# Altium schematic sheet Elekid_03.SchDoc
size A4
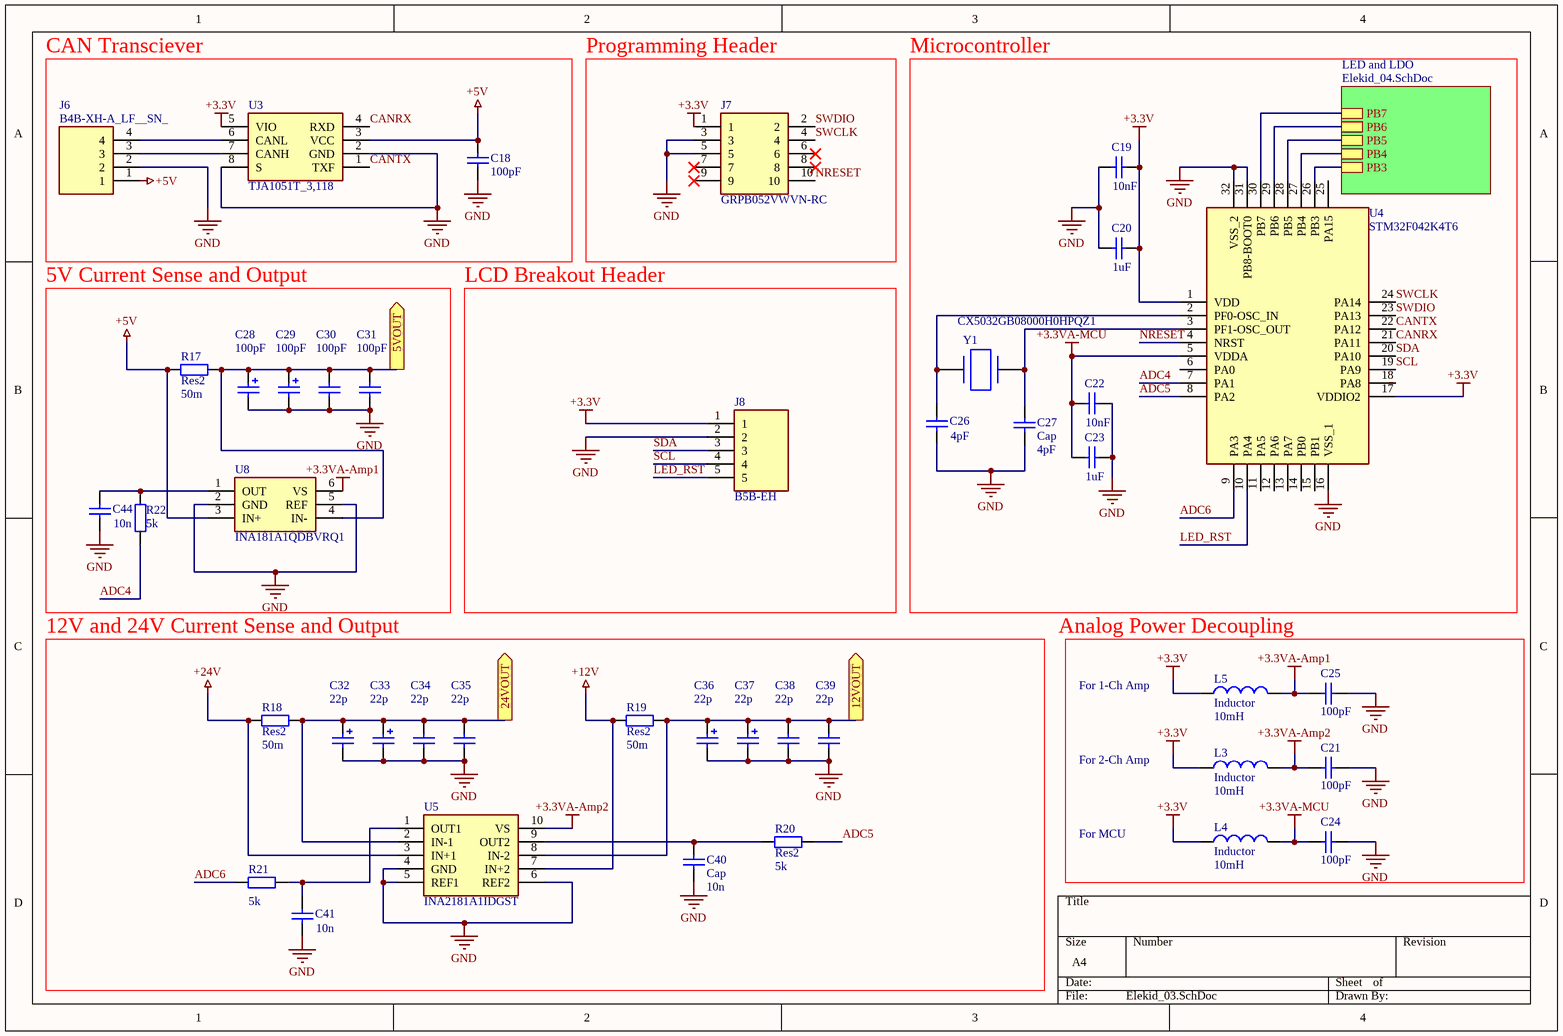
[diagram p0: Elekid_03.SchDoc]

## Parts
C18  value 100pF  [C0805]  (hidden comment: Cap)
C19  value 10nF  [C0805]  (hidden comment: Cap)
C20  value 1uF  [C0805]  (hidden comment: Cap)
C21  value 100pF  [C0805]  (hidden comment: Cap)
C22  value 10nF  [C0805]  (hidden comment: Cap)
C23  value 1uF  [C0805]  (hidden comment: Cap)
C24  value 100pF  [C0805]  (hidden comment: Cap)
C25  value 100pF  [C0805]  (hidden comment: Cap)
C26  value 4pF  [C0805]  (hidden comment: Cap)
C27  Cap  value 4pF  [C0805]
C28  value 100pF  [C0805]  (hidden comment: Cap Pol2)
C29  value 100pF  [C0805]  (hidden comment: Cap Pol2)
C30  value 100pF  [C0805]  (hidden comment: Cap)
C31  value 100pF  [C0805]  (hidden comment: Cap)
C32  value 22p  [C0805]  (hidden comment: Cap Pol2)
C33  value 22p  [C0805]  (hidden comment: Cap Pol2)
C34  value 22p  [C0805]  (hidden comment: Cap)
C35  value 22p  [C0805]  (hidden comment: Cap)
C36  value 22p  [C0805]  (hidden comment: Cap Pol2)
C37  value 22p  [C0805]  (hidden comment: Cap Pol2)
C38  value 22p  [C0805]  (hidden comment: Cap)
C39  value 22p  [C0805]  (hidden comment: Cap)
C40  Cap  value 10n  [C0805]
C41  value 10n  [C0805]  (hidden comment: Cap)
C44  value 10n  [C0805]  (hidden comment: Cap)
J6  B4B-XH-A_LF__SN_  [B4BXHALFSN]
J7  GRPB052VWVN-RC  [HDRV10W50P127_2X5_635X340X430P]
J8  B5B-EH  [SHDR5W64P0X250_1X5_1500X380X600P]
L3  Inductor  value 10mH  [c0805]
L4  Inductor  value 10mH  [c0805]
L5  Inductor  value 10mH  [c0805]
R17  Res2  value 50m  [C1206]
R18  Res2  value 50m  [C1206]
R19  Res2  value 50m  [C1206]
R20  Res2  value 5k  [C0805]
R21  value 5k  [C0805]  (hidden comment: Res2)
R22  value 5k  [C0805]  (hidden comment: Res2)
U3  TJA1051T_3,118  [SOIC127P600X175-8N]
U4  STM32F042K4T6  [QFP80P900X900X160-32N]
U5  INA2181A1IDGST  [SOP50P490X110-10N]
U8  INA181A1QDBVRQ1  [SOT95P280X145-6N]
Y1  CX5032GB08000H0HPQZ1  [CX5032GB08000H0HPQZ1]

## Blocks framed on the sheet
CAN Transciever: C18 J6 U3
Programming Header: J7
Microcontroller: C19 C20 C22 C23 C26 C27 U4 Y1
5V Current Sense and Output: C28-C31 C44 R17 R22 U8
LCD Breakout Header: J8
12V and 24V Current Sense and Output: C32-C41 R18-R21 U5

## Sub-sheets
LED and LDO = Elekid_04.SchDoc: PB7, PB6, PB5, PB4, PB3

## Ports
5VOUT (out), 12VOUT (out), 24VOUT (out)

## Nets
+3.3V: C19.1 C20.1 J7.1 J8.1 L3.1 L4.1 L5.1 U3.5(VIO) U4.1(VDD) U4.17(VDDIO2)
+3.3VA-Amp1: C25.1 L5.2 U8.6(VS)
+3.3VA-Amp2: C21.1 L3.2 U5.10(VS)
+3.3VA-MCU: C22.2 C23.2 C24.1 L4.2 U4.5(VDDA)
+5V: C18.2 J6.1 R17.1 U3.3(VCC) U8.3(IN+)
+12V: R19.1 U5.7(IN+2)
+24V: R18.1 U5.3(IN+1)
GND: C18.1 C19.2 C20.2 C21.2 C22.1 C23.1 C24.2 C25.2 C26.1 C27.1 C28.2 C29.2 C30.1 C31.1 C32.2 C33.2 C34.1 C35.1 C36.2 C37.2 C38.1 C39.1 C40.1 C41.1 C44.1 J6.2 J7.3 J7.5 J8.2 U3.2(GND) U3.8(S) U4.16(VSS_1) U4.31(PB8-BOOT0) U4.32(VSS_2) U5.4(GND) U5.5(REF1) U5.6(REF2) U8.2(GND) U8.5(REF)
5VOUT: C28.1 C29.1 C30.2 C31.2 R17.2 U8.4(IN-) ; port 5VOUT
12VOUT: C36.1 C37.1 C38.2 C39.2 R19.2 U5.8(IN-2) ; port 12VOUT
24VOUT: C32.1 C33.1 C34.2 C35.2 R18.2 U5.2(IN-1) ; port 24VOUT
ADC4: R22.1 U4.7(PA1)
ADC5: R20.2 U4.8(PA2)
ADC6: R21.1 U4.9(PA3)
CANRX: U3.4(RXD) U4.21(PA11)
CANTX: U3.1(TXF) U4.22(PA12)
LED_RST: J8.5 U4.10(PA4)
NRESET: J7.10 U4.4(NRST)
SCL: J8.4 U4.19(PA9)
SDA: J8.3 U4.20(PA10)
SWCLK: J7.4 U4.24(PA14)
SWDIO: J7.2 U4.23(PA13)
NetC26_2: C26.2 U4.2(PF0-OSC_IN) Y1.2
NetC27_2: C27.2 U4.3(PF1-OSC_OUT) Y1.1
NetC40_2: C40.2 R20.1 U5.9(OUT2)
NetC41_2: C41.2 R21.2 U5.1(OUT1)
NetC44_2: C44.2 R22.2 U8.1(OUT)
NetJ6_3: J6.3 U3.7(CANH)
NetJ6_4: J6.4 U3.6(CANL)
NetU4_26: U4.26(PB3) ; sheet LED and LDO/PB3
NetU4_27: U4.27(PB4) ; sheet LED and LDO/PB4
NetU4_28: U4.28(PB5) ; sheet LED and LDO/PB5
NetU4_29: U4.29(PB6) ; sheet LED and LDO/PB6
NetU4_30: U4.30(PB7) ; sheet LED and LDO/PB7

Not connected (* = marked no-connect by the designer): J7 6* 7* 8* 9*; U4 6(PA0) 11(PA5) 12(PA6) 13(PA7) 14(PB0) 15(PB1) 18(PA8) 25(PA15)

## Notes on the sheet
- Analog Power Decoupling
- For 1-Ch Amp
- For 2-Ch Amp
- For MCU

## Library data of the parts
C18-C27 C30 C31 C34 C35 C38-C41 C44 = Cap: Capacitor; Published: 8-Jun-2000; LatestRevisionDate: 17-Jul-2002; LatestRevisionNote: Re-released for DXP Platform.; PackageReference: RAD-0.3; Publisher: Altium Limited; PackageDescription: Radial Cap, Thru-Hole; 2 Leads; 0.3 in Pin Spacing
C28 C29 C32 C33 C36 C37 = Cap Pol2: Polarized Capacitor (Axial); Published: 8-Jun-2000; LatestRevisionDate: 17-Jul-2002; LatestRevisionNote: Re-released for DXP Platform.; PackageReference: POLAR0.8; Publisher: Altium Limited; PackageDescription: Polarized Capacitor; 2 Leads
J6 = B4B-XH-A_LF__SN_: Connector; Manufacturer_Name: JST Sales America; Manufacturer_Part_Number: B4B-XH-A(LF)(SN); Datasheet Link: https://datasheet.lcsc.com/szlcsc/JST-Sales-America-B4B-XH-A-LF-SN_C144395.pdf; Height: 7mm; Arrow Part Number: B4B-XH-A(LF)(SN)
J7 = GRPB052VWVN-RC: Connector; Manufacturer_Name: Sullins; Datasheet Link: https://media.digikey.com/pdf/Data%20Sheets/Sullins%20PDFs/GRPB_%20_2VWVN-RC%2010954-C.pdf; Height: 4.3mm; Manufacturer_Part_Number: GRPB052VWVN-RC; Arrow Part Number: GRPB052VWVN-RC
J8 = B5B-EH: Connector; Manufacturer_Name: JST (JAPAN SOLDERLESS TERMINALS); Datasheet Link: http://www.jst-mfg.com/product/pdf/eng/eEH.pdf; Height: 6mm; Manufacturer_Part_Number: B5B-EH
L3-L5 = Inductor: Code_IEC: 1005; Published: 8-Jun-2000; LatestRevisionDate: 29-May-2009; LatestRevisionNote: IPC-7351 Footprint Added.; PackageReference: 0402-A; Publisher: Altium Limited; PackageDescription: Chip Inductor; Code_JEITA: 0402
R17-R22 = Res2: Resistor; Published: 8-Jun-2000; LatestRevisionDate: 17-Jul-2002; LatestRevisionNote: Re-released for DXP Platform.; PackageReference: AXIAL-0.4; Publisher: Altium Limited; PackageDescription: Axial Device, Thru-Hole; 2 Leads; 0.4 in Pin Spacing
U3 = TJA1051T_3,118: Integrated Circuit; Manufacturer_Name: NXP; Manufacturer_Part_Number: TJA1051T/3,118; Datasheet Link: http://www.nxp.com/docs/en/data-sheet/TJA1051.pdf; Height: 1.75mm; Arrow Part Number: TJA1051T/3,118; Arrow Price/Stock: https://www.arrow.com/en/products/tja1051t3118/nxp-semiconductors; Mouser Part Number: 771-TJA1051T3118; Mouser Price/Stock: https://www.mouser.co.uk/ProductDetail/NXP-Semiconductors/TJA1051T-3118?qs=O%2F7ihdSJpebv1PFlp05wnQ%3D%3D
U4 = STM32F042K4T6: Integrated Circuit; Manufacturer_Name: STMicroelectronics; Datasheet Link: https://www.mouser.com/datasheet/2/389/stm32f042c4-956225.pdf; Height: 1.6mm; Manufacturer_Part_Number: STM32F042K4T6; Arrow Part Number: STM32F042K4T6; Arrow Price/Stock: https://www.arrow.com/en/products/stm32f042k4t6/stmicroelectronics; Mouser Part Number: 511-STM32F042K4T6; Mouser Price/Stock: https://www.mouser.co.uk/ProductDetail/STMicroelectronics/STM32F042K4T6?qs=ClYTdQWm4hDAfZj5dd9NhA%3D%3D
U5 = INA2181A4IDGST: Integrated Circuit; Manufacturer_Name: Texas Instruments; Datasheet Link: http://www.ti.com/lit/ds/symlink/ina2181.pdf; Height: 1.1mm; Manufacturer_Part_Number: INA2181A4IDGST; Arrow Part Number: INA2181A4IDGST; Arrow Price/Stock: https://www.arrow.com/en/products/ina2181a4idgst/texas-instruments; Mouser Part Number: 595-INA2181A4IDGST; Mouser Price/Stock: https://www.mouser.co.uk/ProductDetail/Texas-Instruments/INA2181A4IDGST?qs=j%252B1pi9TdxUbPFaAVw1%2FxVg%3D%3D
U8 = INA181A1QDBVRQ1: Integrated Circuit; Manufacturer_Name: Texas Instruments; Datasheet Link: http://www.ti.com/lit/gpn/INA181-Q1; Height: 1.45mm; Manufacturer_Part_Number: INA181A1QDBVRQ1; Arrow Part Number: INA181A1QDBVRQ1; Arrow Price/Stock: https://www.arrow.com/en/products/ina181a1qdbvrq1/texas-instruments; Mouser Part Number: 595-INA181A1QDBVRQ1; Mouser Price/Stock: https://www.mouser.co.uk/ProductDetail/Texas-Instruments/INA181A1QDBVRQ1?qs=EBDBlbfErPx7yYU5sEtaJQ%3D%3D
Y1 = CX5032GB08000H0HPQZ1: Crystal or Oscillator; Manufacturer_Name: Kyocera Electronic Components; Datasheet Link: https://media.digikey.com/pdf/Data%20Sheets/AVX%20PDFs/CX5032GB0yyyyyH0HPQZ1_Series_Spec.pdf; Height: 1.1mm; Manufacturer_Part_Number: CX5032GB08000H0HPQZ1; Arrow Part Number: CX5032GB08000H0HPQZ1; Mouser Part Number: 581-CX532GB8HHPQZ1; Mouser Price/Stock: https://www.mouser.co.uk/ProductDetail/Kyocera-Electronic-Components/CX5032GB08000H0HPQZ1?qs=mFMVSnANsC2SO%252B6cjFFj8w%3D%3D